# EAGLE schematic tinylab_09-03-16 (EAGLE 7.5.0)
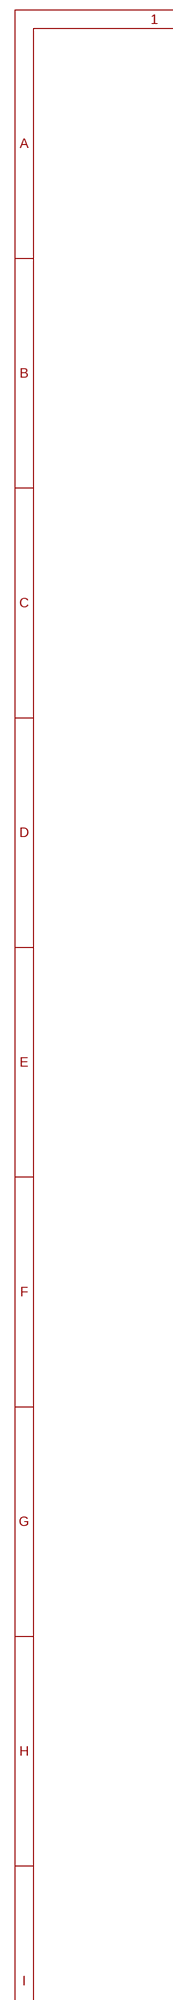
[diagram p0: schematic, sheet 1, part 1 of 2]
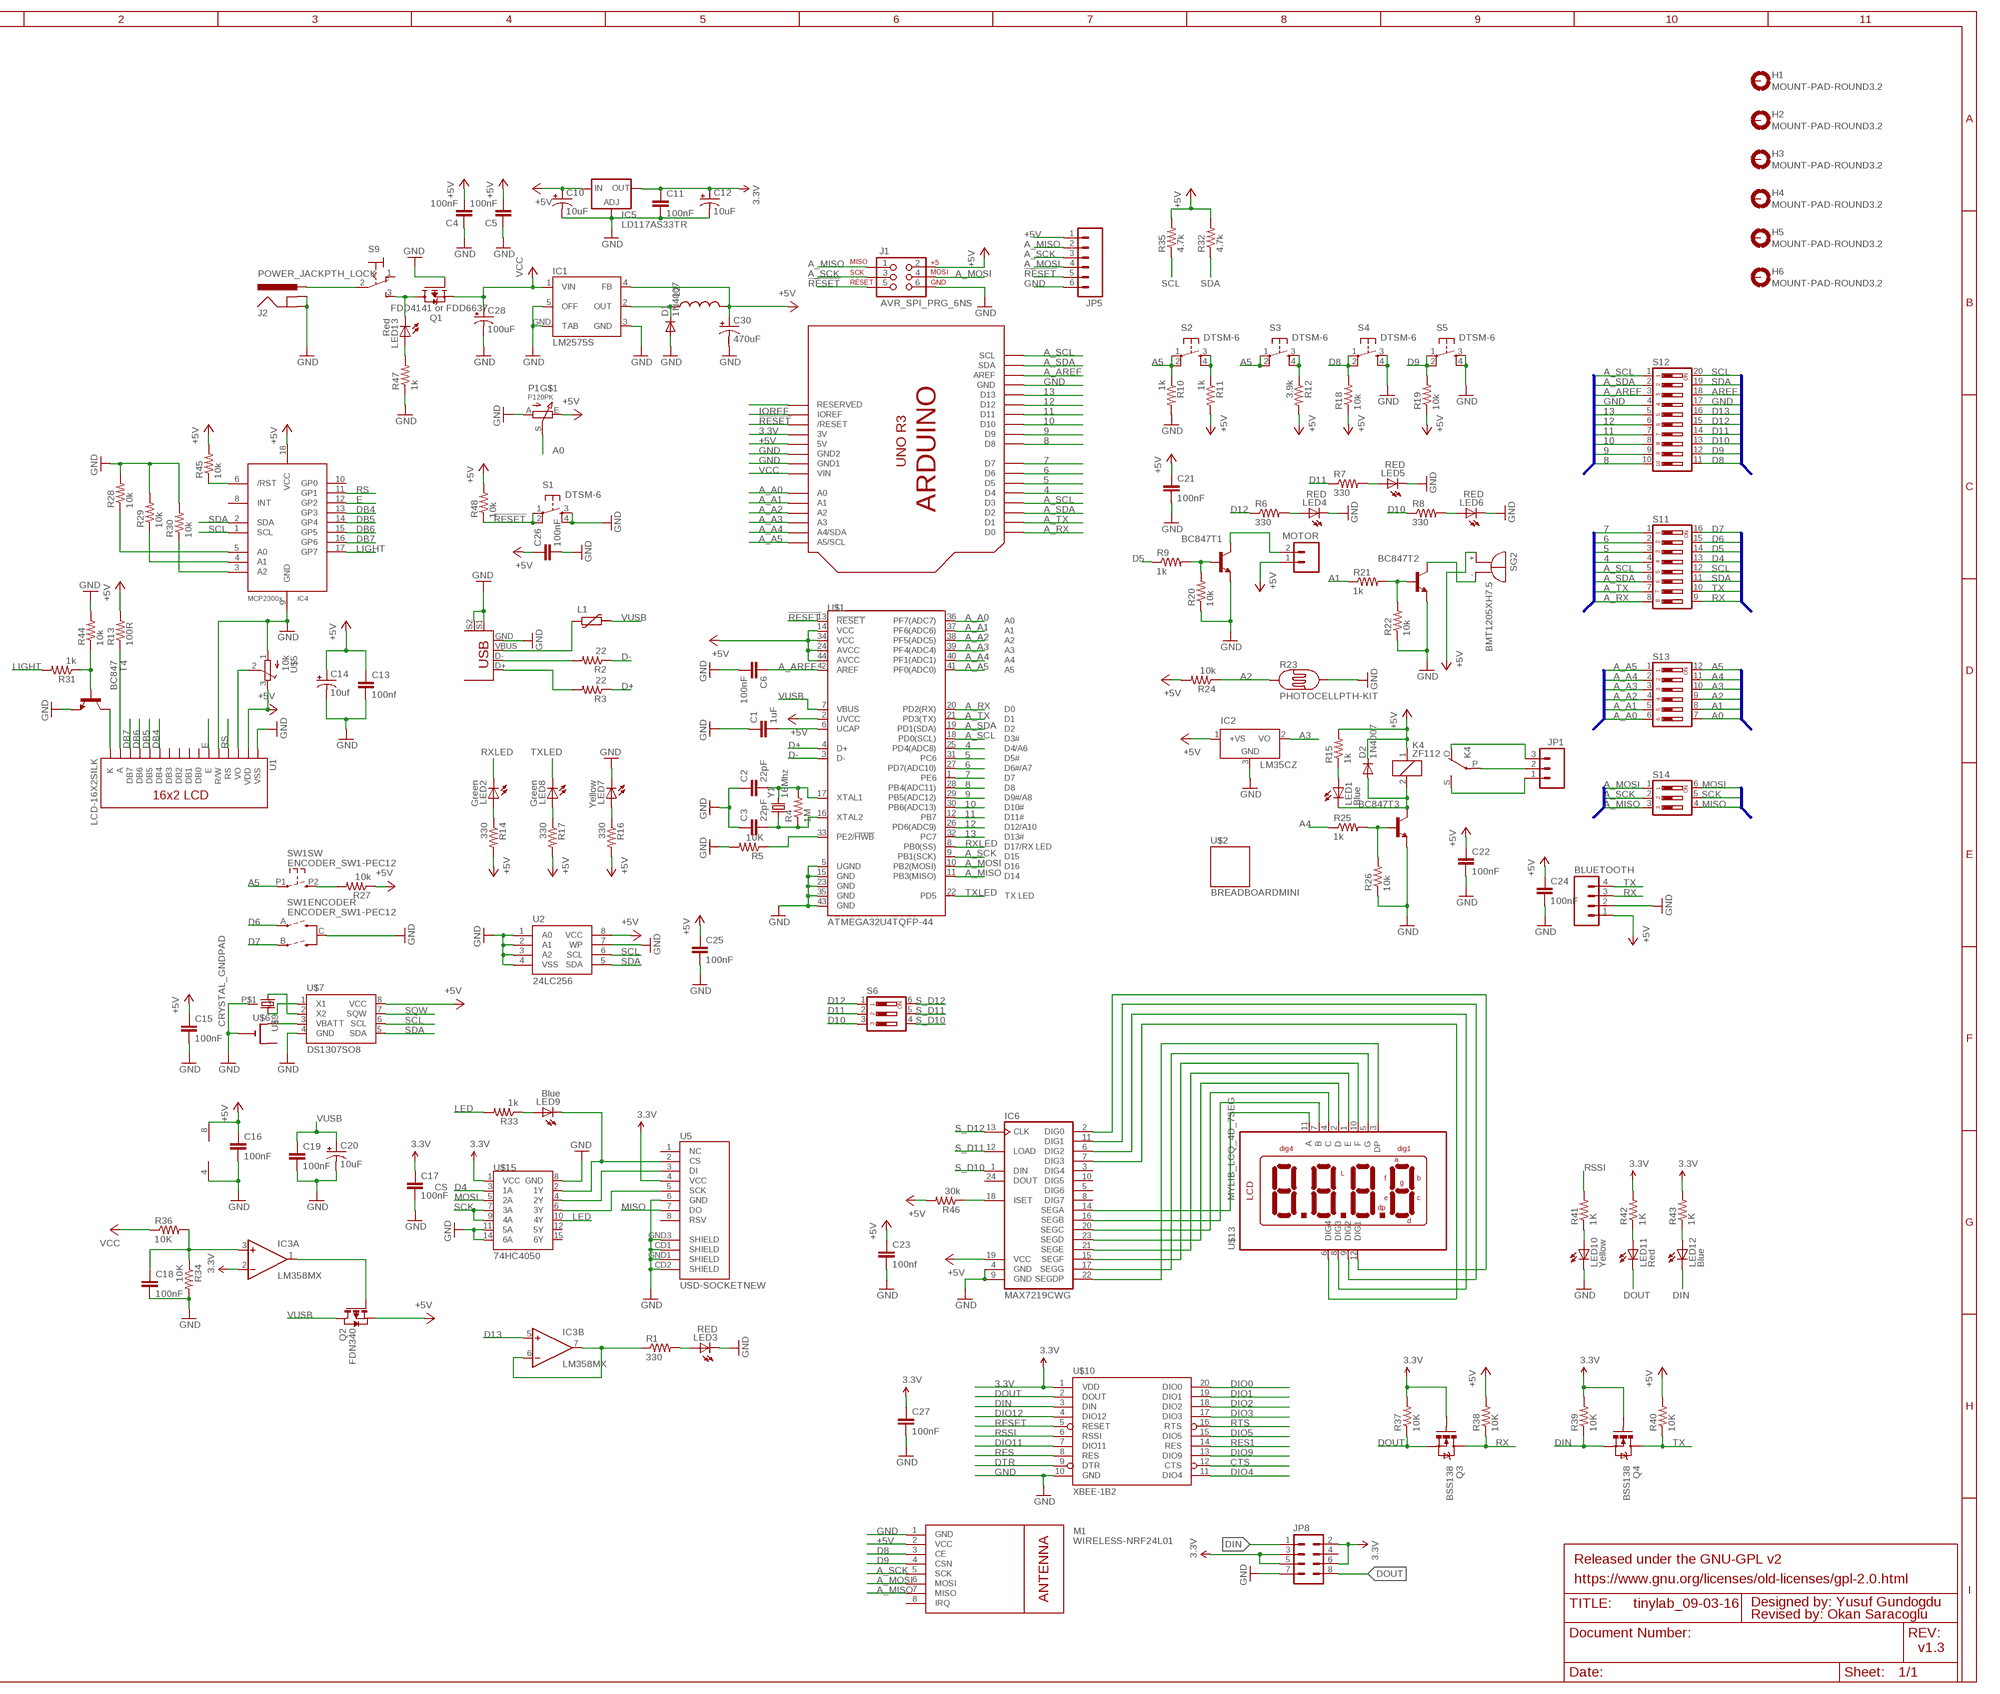
[diagram p1: schematic, sheet 1, part 2 of 2]

## Parts
BLUETOOTH  M04PTH  [1X04]
C1  1uF  CAP1206  [1206]
C2  22pF  CAP0805  [0805]
C3  22pF  CAP0805  [0805]
C4  100nF  CAP0805  [0805]
C5  100nF  CAP0805  [0805]
C6  100nF  CAP0805  [0805]
C10  10uF  CAP_POL1206  [EIA3216]
C11  100nF  CAP0805  [0805]
C12  10uF  CAP_POL1206  [EIA3216]
C13  100nf  CAP0805  [0805]
C14  10uf  CAP_POL1206  [EIA3216]
C15  100nF  CAP0805  [0805]
C16  100nF  CAP0805  [0805]
C17  100nF  CAP0805  [0805]
C18  100nF  CAP0805  [0805]
C19  100nF  CAP0805  [0805]
C20  10uF  CAP_POL1206  [EIA3216]
C21  100nF  CAP0805  [0805]
C22  100nF  CAP0805  [0805]
C23  100nf  CAP0805  [0805]
C24  100nF  CAP0805  [0805]
C25  100nF  CAP0805  [0805]
C26  100nF  CAP0805  [0805]
C27  100nF  CAP0805  [0805]
C28  100uF  CAP_POLF80  [NIPPON_F80]
C30  470uF  CAP_POLG  [PANASONIC_G]
D1  1N4007  DIODESMA-ALT  [SMA-DIODE_ALT]
D2  1N4007  DIODESMA-ALT  [SMA-DIODE_ALT]
H1  MOUNT-PAD-ROUND3.2  [3,2-PAD]
H2  MOUNT-PAD-ROUND3.2  [3,2-PAD]
H3  MOUNT-PAD-ROUND3.2  [3,2-PAD]
H4  MOUNT-PAD-ROUND3.2  [3,2-PAD]
H5  MOUNT-PAD-ROUND3.2  [3,2-PAD]
H6  MOUNT-PAD-ROUND3.2  [3,2-PAD]
IC1  LM2575S  [TO263-5]
IC2  LM35CZ  [TO92]
IC3  LM358MX  [SO08]
IC4  MCP2300X/SO  [SO18W]
IC5  LD117AS33TR  [SOT223]
IC6  MAX7219CWG  [SO24W]
J1  AVR_SPI_PRG_6NS  [2X3-NS]
J2  POWER_JACKPTH_LOCK  [POWER_JACK_PTH_LOCK]
JP1  M03-SCREW-5MM  [SCREWTERMINAL-5MM-3]
JP5  M06SIP  [1X06]
JP8  M04X2  [2X4]
K4  ZF112  [ZF112]
L1  FUSE_PTC-0805  [PTC0805]
L2  INDUCTORPWR  [CDRH125]
LED1  Blue  LEDCHIPLED_0805  [CHIPLED_0805]
LED2  Green  LEDCHIPLED_0805  [CHIPLED_0805]
LED3  RED  LED5MM  [LED5MM]
LED4  RED  LED5MM  [LED5MM]
LED5  RED  LED5MM  [LED5MM]
LED6  RED  LED5MM  [LED5MM]
LED7  Yellow  LEDCHIPLED_0805  [CHIPLED_0805]
LED8  Green  LEDCHIPLED_0805  [CHIPLED_0805]
LED9  Blue  LEDCHIPLED_0805  [CHIPLED_0805]
LED10  Yellow  LEDCHIPLED_0805  [CHIPLED_0805]
LED11  Red  LEDCHIPLED_0805  [CHIPLED_0805]
LED12  Blue  LEDCHIPLED_0805  [CHIPLED_0805]
LED13  Red  LEDCHIPLED_0805  [CHIPLED_0805]
M1  WIRELESS-NRF24L01  [WIRELESS-NRF24L01]
MOTOR  M023.5MM  [SCREWTERMINAL-3.5MM-2]
P1  P120PK  [P120PK]
Q1  FDD4141 or FDD6637  FDD4141TO252  [TO252]
Q2  FDN340  PMOSSOT23  [SOT-23]
Q3  BSS138  MOSFET-NCHANNELSMD  [SOT23-3]
Q4  BSS138  MOSFET-NCHANNELSMD  [SOT23-3]
R1  330  RESISTOR0805-RES  [0805]
R2  22  RESISTOR0805-RES  [0805]
R3  22  RESISTOR0805-RES  [0805]
R4  1M  RESISTOR0805-RES  [0805]
R5  10K  RESISTOR0805-RES  [0805]
R6  330  RESISTOR0805-RES  [0805]
R7  330  RESISTOR0805-RES  [0805]
R8  330  RESISTOR0805-RES  [0805]
R9  1k  RESISTOR0805-RES  [0805]
R10  1k  RESISTOR0805-RES  [0805]
R11  1k  RESISTOR0805-RES  [0805]
R12  3.9k  RESISTOR0805-RES  [0805]
R13  100R  RESISTOR0805-RES  [0805]
R14  330  RESISTOR0805-RES  [0805]
R15  1k  RESISTOR0805-RES  [0805]
R16  330  RESISTOR0805-RES  [0805]
R17  330  RESISTOR0805-RES  [0805]
R18  10k  RESISTOR0805-RES  [0805]
R19  10k  RESISTOR0805-RES  [0805]
R20  10k  RESISTOR0805-RES  [0805]
R21  1k  RESISTOR0805-RES  [0805]
R22  10k  RESISTOR0805-RES  [0805]
R23  PHOTOCELLPTH-KIT  [PHOTOCELL-KIT]
R24  10k  RESISTOR0805-RES  [0805]
R25  1k  RESISTOR0805-RES  [0805]
R26  10k  RESISTOR0805-RES  [0805]
R27  10k  RESISTOR0805-RES  [0805]
R28  10k  RESISTOR0805-RES  [0805]
R29  10k  RESISTOR0805-RES  [0805]
R30  10k  RESISTOR0805-RES  [0805]
R31  1k  RESISTOR0805-RES  [0805]
R32  4.7k  RESISTOR0805-RES  [0805]
R33  1k  RESISTOR0805-RES  [0805]
R34  10K  RESISTOR0805-RES  [0805]
R35  4.7k  RESISTOR0805-RES  [0805]
R36  10K  RESISTOR0805-RES  [0805]
R37  10K  RESISTOR0805-RES  [0805]
R38  10K  RESISTOR0805-RES  [0805]
R39  10K  RESISTOR0805-RES  [0805]
R40  10K  RESISTOR0805-RES  [0805]
R41  1K  RESISTOR0805-RES  [0805]
R42  1K  RESISTOR0805-RES  [0805]
R43  1K  RESISTOR0805-RES  [0805]
R44  10k  RESISTOR0805-RES  [0805]
R45  10k  RESISTOR0805-RES  [0805]
R46  30k  RESISTOR0805-RES  [0805]
R47  1k  RESISTOR0805-RES  [0805]
R48  10k  RESISTOR0805-RES  [0805]
S1  DTSM-6  [DTSM-6]
S2  DTSM-6  [DTSM-6]
S3  DTSM-6  [DTSM-6]
S4  DTSM-6  [DTSM-6]
S5  DTSM-6  [DTSM-6]
S6  DIP03YL  [DIP03YL]
S9  M9040P  [M9040P]
S11  DIP08YL  [DIP08YL]
S12  DIP10YL  [DIP10YL]
S13  DIP06YL  [DIP06YL]
S14  DIP03YL  [DIP03YL]
SG2  BMT1205XH7.5  [BMT1205XH7.5]
SW1  ENCODER_SW1-PEC12  [PEC12_INCREMENTAL_ENCODER]
T1  BC847  MMBT2222ALT1-NPN-SOT23-BEC  [SOT23-BEC]
T2  BC847  MMBT2222ALT1-NPN-SOT23-BEC  [SOT23-BEC]
T3  BC847  MMBT2222ALT1-NPN-SOT23-BEC  [SOT23-BEC]
T4  BC847  MMBT2222ALT1-NPN-SOT23-BEC  [SOT23-BEC]
U1  LCD-16X2SILK  [LCD-16X2]
U2  24LC256  EEPROM-I2CSMD  [SO08]
U5  USD-SOCKETNEW  [MICRO-SD-SOCKET-PP]
U$1  ATMEGA32U4TQFP-44  [TQFP44]
U$2  BREADBOARDMINI  [BREADBOARD-MINI]
U$3  USB+SHIELD  [USB-B-PTH]
U$4  UNO_R3  [UNO_R3]
U$5  10k  TRIMPOTTC33X  [TC33X]
U$6  CR1220SMT  [CR1220-SMD]
U$7  DS1307SO8  [SO08]
U$9  CRYSTAL_GNDPAD  [TC38H_GNDPAD]
U$10  XBEE-1B2  [XBEE-SILK]
U$13  MYLIB_LCQ_4D_7SEG  [MYLIB_LDQ_4D_7SEG]
U$15  74HC4050  HEX_CONVERTER  [SO016]
Y1  16Mhz  CRYSTAL5X3  [CRYSTAL-SMD-5X3]

## Nets
3.3V: C11.1 C12.A(+) C17.1 C27.1 IC3.2(A:-IN) IC5.4(OUT) JP8.2 JP8.3 JP8.5 JP8.6 Q3.1(G) Q4.1(G) R37.2 R39.2 R42.2 R43.2 U5.4(VCC) U$4.3V U$10.1(VDD) U$15.1(VCC)
4: S11.4 U$1.25(PD4(ADC8)) U$4.D4
5: S11.3 U$1.31(PC6) U$4.D5
6: S11.2 U$1.27(PD7(ADC10)) U$4.D6
7: S11.1 U$1.1(PE6) U$4.D7
8: S12.10 U$1.28(PB4(ADC11)) U$4.D8
9: S12.9 U$1.29(PB5(ADC12)) U$4.D9
10: S12.8 U$1.30(PB6(ADC13)) U$4.D10
11: S12.7 U$1.12(PB7) U$4.D11
12: S12.6 U$1.26(PD6(ADC9)) U$4.D12
13: S12.5 U$1.32(PC7) U$4.D13
!RESET: J1.5 JP5.5 R48.1 S1.1 S1.2 U$1.13(!RESET) U$4.RESET(/RESET)
+5V: BLUETOOTH.1 C4.2 C5.2 C10.A(+) C13.1 C14.A(+) C15.1 C16.1 C21.1 C22.1 C23.1 C24.1 C25.1 C26.1 C30.+ D2.C IC1.4(FB) IC2.1(+VS) IC3.8(P:V+) IC4.18(VCC) IC5.3(IN) IC6.19(VCC) J1.2 JP5.1 K4.1 L2.2 M1.2(VCC) MOTOR.1 P1.E Q2.2(S) R11.2 R12.2 R13.2 R14.2 R15.2 R16.2 R17.2 R18.1 R19.1 R24.2 R27.1 R32.2 R35.2 R38.2 R40.2 R45.2 R46.2 R48.2 SG2.+ U1.2(VDD) U2.8(VCC) U$1.2(UVCC) U$1.14(VCC) U$1.24(AVCC) U$1.34(VCC) U$1.44(AVCC) U$4.5V U$5.3(E) U$7.8(VCC)
A0: P1.S S13.7
A1: R21.1 S13.8
A2: R23.1 R24.1 S13.9
A3: IC2.2(VO) S13.10
A4: R25.1 S13.11
A5: R10.1 S2.1 S2.2 S3.1 S3.2 S13.12 SW1.P1
A_A0: S13.6 U$1.36(PF7(ADC7)) U$4.A0
A_A1: S13.5 U$1.37(PF6(ADC6)) U$4.A1
A_A2: S13.4 U$1.38(PF5(ADC5)) U$4.A2
A_A3: S13.3 U$1.39(PF4(ADC4)) U$4.A3
A_A4: S13.2 U$1.40(PF1(ADC1)) U$4.A4(A4/SDA)
A_A5: S13.1 U$1.41(PF0(ADC0)) U$4.A5(A5/SCL)
A_AREF: C6.1 S12.3 U$1.42(AREF) U$4.AREF
A_MISO: J1.1 JP5.2 M1.7(MISO) S14.3 U$1.11(PB3(MISO))
A_MOSI: J1.4 JP5.4 M1.6(MOSI) S14.1 U$1.10(PB2(MOSI))
A_RX: S11.8 U$1.20(PD2(RX)) U$4.D0
A_SCK: J1.3 JP5.3 M1.5(SCK) S14.2 U$1.9(PB1(SCK))
A_SCL: S11.5 S12.1 U$1.18(PD0(SCL)) U$4.D3 U$4.SCL
A_SDA: S11.6 S12.2 U$1.19(PD1(SDA)) U$4.D2 U$4.SDA
A_TX: S11.7 U$1.21(PD3(TX)) U$4.D1
AREF: S12.18
CTS: U$10.12(CTS)
D4: S11.13 U$15.3(1A)
D5: R9.1 S11.14
D6: S11.15 SW1.A(ENCODER:A)
D7: S11.16 SW1.B(ENCODER:B)
D8: M1.3(CE) R18.2 S4.1 S4.2 S12.11
D9: M1.4(CSN) R19.2 S5.1 S5.2 S12.12
D10: R8.1 S6.3 S12.13
D11: R7.1 S6.2 S12.14
D12: R6.1 S6.1 S12.15
D13: IC3.5(B:+IN) S12.16
D+: R3.1 U$1.4(D+)
D-: R2.1 U$1.3(D-)
DB4: IC4.13(GP3) U1.11(DB4)
DB5: IC4.14(GP4) U1.12(DB5)
DB6: IC4.15(GP5) U1.13(DB6)
DB7: IC4.16(GP6) U1.14(DB7)
DIN: JP8.1 LED12.C Q4.2(S) R39.1 U$10.3(DIN)
DIO0: U$10.20(DIO0)
DIO1: U$10.19(DIO1)
DIO2: U$10.18(DIO2)
DIO3: U$10.17(DIO3)
DIO4: U$10.11(DIO4)
DIO5: U$10.15(DIO5)
DIO9: U$10.13(DIO9)
DIO11: U$10.7(DIO11)
DIO12: U$10.4(DIO12)
DOUT: JP8.8 LED11.C Q3.2(S) R37.1 U$10.2(DOUT)
DTR: U$10.9(DTR)
E: IC4.12(GP2) U1.6(E)
GND: BLUETOOTH.2 C1.1 C2.1 C3.1 C4.1 C5.1 C6.2 C10.C(-) C11.2 C12.C(-) C13.2 C14.C(-) C15.2 C16.2 C17.2 C18.2 C19.2 C20.C(-) C21.2 C22.2 C23.2 C24.2 C25.2 C26.2 C27.2 C28.- C30.- D1.A IC1.3(GND) IC1.5(OFF) IC1.GND(TAB) IC2.3(GND) IC3.4(P:V-) IC4.9(GND) IC5.1(ADJ) IC6.4(GND) IC6.9(GND) J1.6 J2.GND J2.GNDBREAK JP5.6 JP8.7 LED3.K(C) LED4.K(C) LED5.K(C) LED6.K(C) LED7.C LED10.C M1.1(GND) P1.A Q1.1(G) R5.2 R10.2 R20.1 R22.1 R23.2 R26.1 R28.2 R29.2 R30.2 R34.2 R44.2 R47.1 S1.3 S1.4 S4.3 S4.4 S5.3 S5.4 S12.4 S12.17 SW1.C(ENCODER:C) T1.E T2.E T3.E T4.E U1.1(VSS) U1.5(R/W) U2.1(A0) U2.2(A1) U2.3(A2) U2.4(VSS) U2.7(WP) U5.6(GND) U5.CD1(SHIELD) U5.CD2(SHIELD) U5.GND1(SHIELD) U5.GND3(SHIELD) U$1.5(UGND) U$1.15(GND) U$1.23(GND) U$1.35(GND) U$1.43(GND) U$3.GND U$3.S1 U$3.S2 U$4.GND U$4.GND1 U$4.GND2 U$5.1(A) U$6.- U$7.4(GND) U$9.P$1 U$10.10(GND) U$15.8(GND) U$15.11(5A) U$15.14(6A)
IOREF: U$4.IOREF
LED: R33.2 U$15.10(4Y)
LIGHT: IC4.17(GP7) R31.2
MISO: S14.4 U5.7(DO)
MOSI: S14.6 U$15.5(2A)
N$1: R2.2 U$3.D-
N$2: R3.2 U$3.D+
N$3: LED3.A R1.2
N$4: C1.2 U$1.6(UCAP)
N$5: R11.1 S2.3 S2.4
N$6: C3.2 R4.1 U$1.16(XTAL2) Y1.1
N$7: C2.2 R4.2 U$1.17(XTAL1) Y1.3
N$8: R21.2 R22.2 T2.B
N$9: R5.1 U$1.33(PE2/!HWB)
N$10: D1.C IC1.2(OUT) L2.1
N$11: R12.1 S3.3 S3.4
N$12: R9.2 R20.2 T1.B
N$13: LED4.A R6.2
N$14: JP1.3 K4.O(2:O)
N$15: LED5.A R7.2
N$16: MOTOR.2 T1.C
N$17: LED6.A R8.2
N$18: SG2.- T2.C
N$19: LED1.A R15.1
N$20: R25.2 R26.2 T3.B
N$21: D2.A K4.2 LED1.C T3.C
N$22: LED2.A R14.1
N$23: LED8.A R17.1
N$24: JP1.2 K4.P(2:P)
N$25: JP1.1 K4.S(2:S)
N$26: J2.PWR S9.2(P)
N$27: LED13.C Q1.3(D) S9.3(S)
N$28: U$4.RESERVED
N$29: IC4.5(A0) R28.1
N$30: IC4.4(A1) R29.1
N$31: IC4.3(A2) R30.1
N$32: R27.2 SW1.P2
N$33: R31.1 R44.1 T4.B
N$34: U1.3(VO) U$5.2(S)
N$35: T4.C U1.16(K)
N$36: U$7.2(X2) U$9.1
N$37: U$6.+$1(+) U$7.3(VBATT)
N$38: IC6.14(SEGA) U$13.11(A)
N$39: U5.3(DI) U$15.4(2Y)
N$40: U5.5(SCK) U$15.6(3Y)
N$41: U$7.1(X1) U$9.2
N$42: LED9.A R33.1
N$43: LED9.C U5.2(CS) U$15.2(1Y)
N$44: L1.1 U$3.VBUS
N$45: C18.1 IC3.3(A:+IN) R34.1 R36.2
N$46: LED10.A R41.1
N$47: IC3.1(A:OUT) Q2.3(G)
N$48: IC3.6(B:-IN) IC3.7(B:OUT) R1.1
N$49: LED11.A R42.1
N$50: LED12.A R43.1
N$51: LED13.A R47.2
N$52: IC4.6(/RST) R45.1
N$53: IC6.18(ISET) R46.1
N$54: IC6.16(SEGB) U$13.7(B)
N$55: IC6.20(SEGC) U$13.4(C)
N$56: IC6.23(SEGD) U$13.2(D)
N$57: IC6.21(SEGE) U$13.1(E)
N$58: IC6.15(SEGF) U$13.10(F)
N$59: IC6.17(SEGG) U$13.5(G)
N$60: IC6.22(SEGDP) U$13.3(DP)
N$61: IC6.7(DIG3) U$13.6(DIG4)
N$62: IC6.6(DIG2) U$13.8(DIG3)
N$63: IC6.11(DIG1) U$13.9(DIG2)
N$64: IC6.2(DIG0) U$13.12(DIG1)
N$65: R13.1 U1.15(A)
N$119: LED7.A R16.1
RES: U$10.8(RES)
RES1: U$10.14(RES)
RESET: U$10.5(RESET)
RS: IC4.11(GP1) U1.4(RS)
RSSI: R41.2 U$10.6(RSSI)
RTS: U$10.16(RTS)
RX: BLUETOOTH.3 Q3.3(D) R38.1 S11.9
RXLED: LED2.C U$1.8(PB0(SS))
S_D10: IC6.1(DIN) S6.4
S_D11: IC6.12(LOAD) S6.5
S_D12: IC6.13(CLK) S6.6
SCK: S14.5 U$15.7(3A) U$15.9(4A)
SCL: IC4.1(SCL) R35.1 S11.12 S12.20 U2.6(SCL) U$7.6(SCL)
SDA: IC4.2(SDA) R32.1 S11.11 S12.19 U2.5(SDA) U$7.5(SDA)
SQW: U$7.7(SQW)
TX: BLUETOOTH.4 Q4.3(D) R40.1 S11.10
TXLED: LED8.C U$1.22(PD5)
VCC: C28.+ IC1.1(VIN) Q1.2(S) R36.1 U$4.VIN
VUSB: C19.1 C20.A(+) L1.2 Q2.1(D) U$1.7(VBUS)
Unconnected: H1.B3,2(MOUNT) H2.B3,2(MOUNT) H3.B3,2(MOUNT) H4.B3,2(MOUNT) H5.B3,2(MOUNT) H6.B3,2(MOUNT) IC4.8(INT) IC4.10(GP0) IC6.3(DIG4) IC6.5(DIG6) IC6.8(DIG7) IC6.10(DIG5) IC6.24(DOUT) JP8.4 M1.8(IRQ) P1.M1(GND) P1.M2(GND) S9.1(O) U1.7(DB0) U1.8(DB1) U1.9(DB2) U1.10(DB3) U5.1(NC) U5.8(RSV) U$6.+$2(+1) U$15.12(5Y) U$15.15(6Y)

## Buses
SCL,SDA,AREF,GND,D13,D12,D11,D10,D9,D8
D7,D6,D5,D4,SCL,SDA,TX,RX
A0,A1,A2,A3,A4,A5
A_SCL,A_SDA,A_AREF,GND,13,12,11,10,9,8
7,6,5,4,A_SCL,A_SDA,A_TX,A_RX
A_A0,A_A1,A_A2,A_A3,A_A4,A_A5
MOSI,SCK,MISO
A_MOSI,A_SCK,A_MISO

## Notes on the sheet
- CS
- Released under the GNU-GPL v2
- https://www.gnu.org/licenses/old-licenses/gpl-2.0.html
- Designed by: Yusuf Gundogdu
- Revised by: Okan Saracoglu
- v1.3

## Library data of the parts
BLUETOOTH = SparkFun:M04: Header 4 Standard 4-pin 0.1" header. Use with straight break away headers (SKU : PRT-00116), right angle break away headers (PRT-00553), swiss pins (PRT-00743), machine pins (PRT-00117), and female headers (PRT-00115). Molex polarized connector foot print use with SKU : PRT-08231 with associated crimp pins and housings. 1MM SMD Version SKU: PRT-10208
C1-C6 C11 C13 C15-C19 C21-C27 = SparkFun:CAP: Capacitor Standard 0603 ceramic capacitor, and 0.1" leaded capacitor.
C10 C12 C14 C20 C28 C30 = SparkFun:CAP_POL: Capacitor Polarized These are standard SMD and PTH capacitors. Normally 10uF, 47uF, and 100uF in electrolytic and tantalum varieties. Always verify the external diameter of the through hole cap, it varies with capacity, voltage, and manufacturer. The EIA devices should be standard.
D1 D2 = SparkFun:DIODE: Diode These are standard reverse protection diodes and small signal diodes. SMA package can handle up to about 1A. SOD-323 can handle about 200mA. What the SOD-323 package when ordering, there are some mfgs out there that are 5-pin packages.
H1-H6 = holes:MOUNT-PAD-ROUND: MOUNTING PAD, round
IC1 = v-reg-3:LM2575: National Semiconductor <http://www.national.com> 1.0A "Simple Switcher"(c) 52kHz, Vout 1.23-37V (HV: 57V), Vin 40V (HV: 60V), 50µA standby current
IC2 = lm35:LM35: Single-Supply Centigrade Temperature Sensor Vout = (10mV/°C x Temp °C) +5mmmV Source: http://www.national.com/ds/LM/LM35.pdf
IC3 = linear:LM358: OP AMP also LM158; LM258; LM2904 Source: http://cache.national.com/ds/LM/LM158.pdf
IC4 = adafruit:MCP2300X: MCP23008 Inexpensive i2c i/o expander - 8 general purpose i/o pins with optional pullups
IC5 = v-reg:LD117A?*: Low drop fixed and adjustable positive voltage regulators 1 A Source: http://www.st.com/stonline/products/literature/ds/7194/ld1117axx.pdf
IC6 = maxim-10:MAX7219*: Serially Interfaced, 8-Digit LED Display Drivers
J1 = SparkFun:AVR_SPI_PRG_6: AVR ISP 6 Pin This is the reduced ISP connector for AVR programming. Common on Arduino. This footprint will take up less PCB space and can be used with a 10-pin to 6-pin adapter such as SKU: BOB-08508
J2 = SparkFun:POWER_JACK: Power Jack This is the standard 5.5mm barrel jack for power. The PTH is the most common, proven, reliable, footprint. All others are experimental. The Slot footprint only works if the mill layer is transmitted to the PCB fab house so be warned. Spark Fun Electronics SKU : PRT-00119. Mating wall wart : TOL-00298 (and others)
JP1 = SparkFun:M03: Header 3 Standard 3-pin 0.1" header. Use with straight break away headers (SKU : PRT-00116), right angle break away headers (PRT-00553), swiss pins (PRT-00743), machine pins (PRT-00117), and female headers (PRT-00115). Molex polarized connector foot print use with SKU : PRT-08232 with associated crimp pins and housings.
JP5 = SparkFun:M06: Header 6 Standard 6-pin 0.1" header. Use with straight break away headers (SKU : PRT-00116), right angle break away headers (PRT-00553), swiss pins (PRT-00743), machine pins (PRT-00117), and female headers (PRT-00115). Molex polarized connector foot print use with SKU : PRT-08094 with associated crimp pins and housings. NOTES ON THE VARIANTS LOCK and LOCK_LONGPADS... This footprint was designed to help hold the alignment of a through-hole component (i.e. 6-pin header) while soldering it into place. You may notice that each hole has been shifted either up or down by 0.005 of an inch from it's more standard position (which is a perfectly straight line). This slight alteration caused the pins (the squares in the middle) to touch the edges of the holes. Because they are alternating, it causes a "brace" to hold the component in place. 0.005 has proven to be the perfect amount of "off-center" position when using our standard breakaway headers. Although looks a little odd when you look at the bare footprint, once you have a header in there, the alteration is very hard to notice. Also, if you push a header all the way into place, it is covered up entirely on the bottom side. This idea of altering the position of holes to aid alignment will be further integrated into the Sparkfun Library for other footprints. It can help hold any component with 3 or more connection pins.
JP8 = SparkFun-Connectors:M04X2: .1" header, two rows of four.
K4 = relay:ZF112: RELAY 1 x switch; OC_FARNELL: unknown; OC_NEWARK: unknown
L1 = dp_devices:FUSE_PTC: Resettable PTC
L2 = SparkFun:INDUCTOR: Inductors Basic Inductor/Choke - 0603 and 1206. Footprints are not proven and vary greatly between part numbers.
LED1 LED2 LED7-LED13 = led:LED: LED OSRAM: - CHIPLED LG R971, LG N971, LY N971, LG Q971, LY Q971, LO R971, LY R971 LH N974, LH R974 LS Q976, LO Q976, LY Q976 LO Q996 - Hyper CHIPLED LW Q18S LB Q993, LB Q99A, LB R99A - SideLED LS A670, LO A670, LY A670, LG A670, LP A670 LB A673, LV A673, LT A673, LW A673 LH A674 LY A675 LS A676, LA A676, LO A676, LY A676, LW A676 LS A679, LY A679, LG A679 - Hyper Micro SIDELED® LS Y876, LA Y876, LO Y876, LY Y876 LT Y87S - SmartLED LW L88C, LW L88S LB L89C, LB L89S, LG L890 LS L89K, LO L89K, LY L89K LS L896, LA L896, LO L896, LY L896 - TOPLED LS T670, LO T670, LY T670, LG T670, LP T670 LSG T670, LSP T670, LSY T670, LOP T670, LYG T670 LG T671, LOG T671, LSG T671 LB T673, LV T673, LT T673, LW T673 LH T674 LS T676, LA T676, LO T676, LY T676, LB T676, LH T676, LSB T676, LW T676 LB T67C, LV T67C, LT T67C, LS T67K, LO T67K, LY T67K, LW E67C LS E67B, LA E67B, LO E67B, LY E67B, LB E67C, LV E67C, LT E67C LW T67C LS T679, LY T679, LG T679 LS T770, LO T770, LY T770, LG T770, LP T770 LB T773, LV T773, LT T773, LW T773 LH T774 LS E675, LA E675, LY E675, LS T675 LS T776, LA T776, LO T776, LY T776, LB T776 LHGB T686 LT T68C, LB T68C - Hyper Mini TOPLED® LB M676 - Mini TOPLED Santana® LG M470 LS M47K, LO M47K, LY M47K Source: http://www.osram.convergy.de LUXEON: - LUMILED® LXK2-PW12-R00, LXK2-PW12-S00, LXK2-PW14-U00, LXK2-PW14-V00 LXK2-PM12-R00, LXK2-PM12-S00, LXK2-PM14-U00 LXK2-PE12-Q00, LXK2-PE12-R00, LXK2-PE12-S00, LXK2-PE14-T00, LXK2-PE14-U00 LXK2-PB12-K00, LXK2-PB12-L00, LXK2-PB12-M00, LXK2-PB14-N00, LXK2-PB14-P00, LXK2-PB14-Q00 LXK2-PR12-L00, LXK2-PR12-M00, LXK2-PR14-Q00, LXK2-PR14-R00 LXK2-PD12-Q00, LXK2-PD12-R00, LXK2-PD12-S00 LXK2-PH12-R00, LXK2-PH12-S00 LXK2-PL12-P00, LXK2-PL12-Q00, LXK2-PL12-R00 Source: www.luxeon.com KINGBRIGHT: KA-3528ASYC Source: www.kingbright.com
LED3-LED6 = SparkFun:LED: LEDs Standard schematic elements and footprints for 5mm, 3mm, 1206, and 0603 sized LEDs. 5mm - Spark Fun Electronics SKU : COM-00529 (and others)
M1 = diy-modules:WIRELESS-NRF24L01: 2.4 GHz Wireless Module based on NRF24L01 chip
MOTOR = SparkFun:M02: Header 2 Standard 2-pin 0.1" header. Use with straight break away headers (SKU : PRT-00116), right angle break away headers (PRT-00553), swiss pins (PRT-00743), machine pins (PRT-00117), and female headers (PRT-00115). Molex polarized connector foot print use with SKU : PRT-08233 with associated crimp pins and housings.
P1 = pot-tt_electronics:P120PK
Q1 = transistor-fet:FDD4141: P-Channel PowerTrench® MOSFET Source: FDD4141.pdf
Q2 = zetex:PMOSSOT23: MOS FET; OC_FARNELL: unknown; OC_NEWARK: unknown
Q3 Q4 = SparkFun:MOSFET-NCHANNEL
R1-R22 R24-R48 = SparkFun:RESISTOR: Resistor Basic schematic elements and footprints for 0603, 1206, and PTH resistors.
R23 = SparkFun:PHOTOCELL: Photocell Also known as a CdS photoresistor. This is a low cost way to detect light levels. Resistance decreases with more incoming light. SparkFun SKU: SEN-09088
S1-S5 = switch-tact:DTSM-6
S6 S14 = switch-dil:DIP03YL: DIL/CODE SWITCH; OC_FARNELL: unknown; OC_NEWARK: unknown
S9 = switch:M9040P: TOGGLE SWITCH Marquardt
S11 = switch-dil:DIP08YL: DIL/CODE SWITCH; OC_FARNELL: unknown; OC_NEWARK: unknown
S12 = switch-dil:DIP10YL: DIL/CODE SWITCH; OC_FARNELL: unknown; OC_NEWARK: unknown
S13 = switch-dil:DIP06YL: DIL/CODE SWITCH; OC_FARNELL: unknown; OC_NEWARK: unknown
SG2 = buzzer:BMT1205XH7.5: MAGNETIC TRANSDUCER Source: Http:www.be-star.com; OC_FARNELL: unknown; OC_NEWARK: unknown
SW1 = dp_devices:ENCODER_SW1: Incremental Encoder with push switch
T1-T4 = transistor:*-NPN-: NPN Transistror BF959 corrected 2008.03.06
U1 = SparkFun:LCD-16X2
U2 = SparkFun-DigitalIC:EEPROM-I2C: I2C EEPROM chips, 24LC256 (and others)
U5 = SparkFun:USD-SOCKET: microSD Socket Push-push type uSD socket. Schematic element and footprint production proven. Spark Fun Electronics SKU : PRT-00127. tDoc lines correctly indicate media card edge positions when inserting (unlocked, locked, depressed).
U$1 = SparkFun-DigitalIC:ATMEGA32U4: Atmel 44-pin 8-bit Microcontroller with 32KBytes of ISP Flash and USB Controller
U$2 = SparkFun:BREADBOARD: Breadboard Mini Self Adhesive This is the mechnical outline for the very small self adhesive breadboard from SparkFun Electronics. Good for very small proto areas. SKU : PRT-07916
U$3 = SparkFun:USB+SHIELD: USB+Shield USB connector with shield pins connectable
U$4 = UNO_R3:UNO_R3
U$5 = adafruit:TRIMPOT: SMT trimmer potentiometer part number TC33X http://www.ladyada.net/library/eagle
U$6 = adafruit:CR1220: CR1216/CR1220/CR1225 12mm 3V lithium coin cell Great for battery packup. Both SMT and THM holders. Note the THM package has the ground pads on both sides of the PCB so that the masks are the same - this reduces the cost
U$7 = SparkFun:DS1307
U$9 = crystal:CRYSTAL_GNDPAD
U$10 = SparkFun:XBEE-1
U$13 = 4_Digit_DIsplay:MYLIB_LCQ_4D_7SEG
U$15 = SparkFun:HEX_CONVERTER
Y1 = SparkFun:CRYSTAL: Crystals Various standard crystals. Proven footprints. Spark Fun Electronics SKU : COM-00534